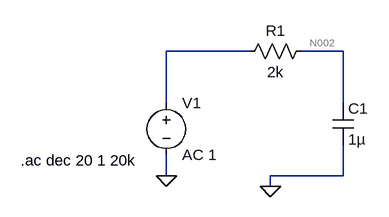
[diagram p0: schematic capacitive design.asc]
capacitive design.asc, the LTspice schematic file:
Version 4
SHEET 1 880 680
WIRE 144 32 16 32
WIRE 288 32 224 32
WIRE 16 112 16 32
WIRE 288 112 288 32
WIRE 16 224 16 192
WIRE 288 224 288 176
WIRE 288 224 176 224
WIRE 176 240 176 224
FLAG 176 240 0
FLAG 16 224 0
SYMBOL voltage 16 96 R0
WINDOW 123 0 0 Left 0
WINDOW 39 0 0 Left 0
SYMATTR InstName V1
SYMATTR Value AC 1
SYMBOL cap 272 112 R0
SYMATTR InstName C1
SYMATTR Value 1µ
SYMBOL res 240 16 R90
WINDOW 0 0 56 VBottom 2
WINDOW 3 32 56 VTop 2
SYMATTR InstName R1
SYMATTR Value 2k
TEXT -208 200 Left 2 !.ac dec 20 1 20k

The netlist it stands for:
* capacitive design.asc
V1 N001 0 AC 1
C1 N002 0 1µ
R1 N002 N001 2k
.ac dec 20 1 20k
.backanno
.end

* Results of the author's LTspice run, read from the files saved beside the schematic
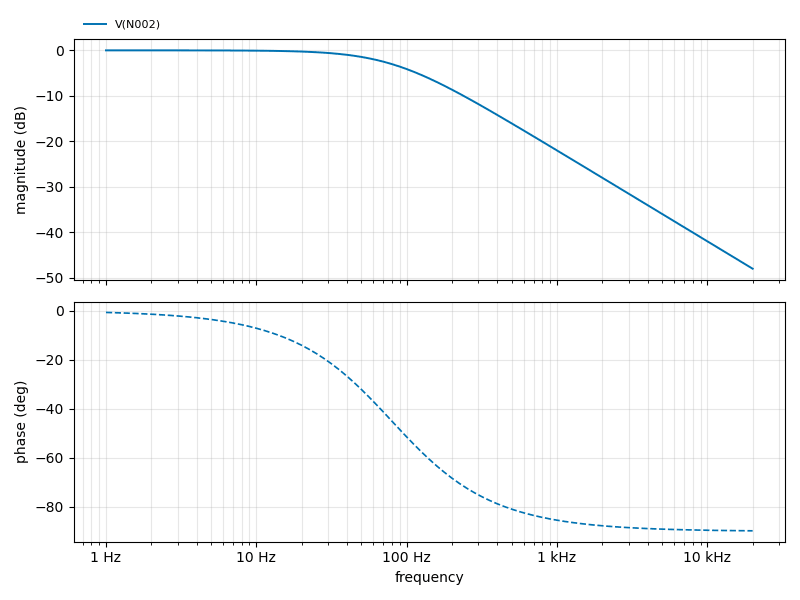
[diagram p1: AC Analysis of capacitive design.asc, plotted from the saved traces]
* AC Analysis, 1 run:
*   V(N002): -0.00 dB at 1 Hz, -48.00 dB at 20 kHz, peak -0.00 dB at 1 Hz, 3 dB below the peak at 79.58 Hz